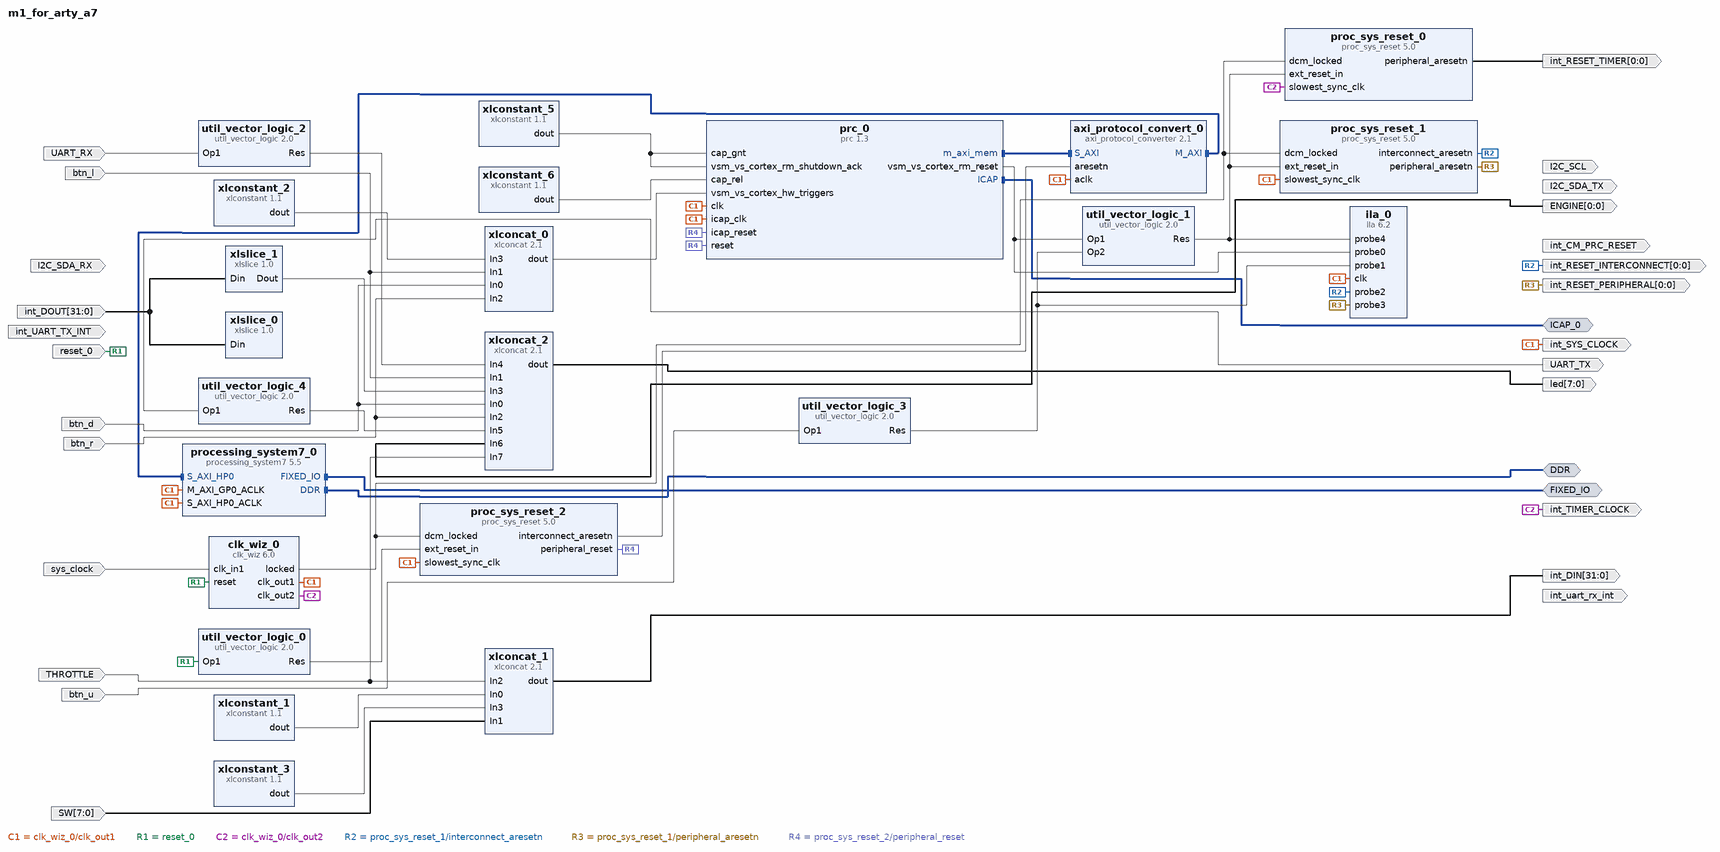
[diagram p0: block diagram of the top level]
# Vivado block design m1_for_arty_a7, xc7z020clg484-1, Vivado 2018.3
create_bd_design m1_for_arty_a7

create_bd_intf_port -mode Master -vlnv xilinx.com:interface:ddrx_rtl:1.0 DDR
create_bd_intf_port -mode Master -vlnv xilinx.com:display_processing_system7:fixedio_rtl:1.0 FIXED_IO
create_bd_intf_port -mode Master -vlnv xilinx.com:interface:icap_rtl:1.0 ICAP_0
create_bd_port -dir I -type rst reset_0
set_property -dict {CONFIG.POLARITY ACTIVE_HIGH} [get_bd_ports reset_0]
create_bd_port -dir I UART_RX
create_bd_port -dir I -type clk sys_clock
set_property -dict {CONFIG.FREQ_HZ 100000000 CONFIG.PHASE 0.000} [get_bd_ports sys_clock]
create_bd_port -dir O UART_TX
create_bd_port -dir I I2C_SDA_RX
create_bd_port -dir I THROTTLE
create_bd_port -dir O -from 7 -to 0 led
create_bd_port -dir O I2C_SDA_TX
create_bd_port -dir O I2C_SCL
create_bd_port -dir O -from 0 -to 0 ENGINE
create_bd_port -dir I -from 7 -to 0 SW
create_bd_port -dir O -from 0 -to 0 -type rst int_RESET_INTERCONNECT
create_bd_port -dir O -from 0 -to 0 -type rst int_RESET_PERIPHERAL
create_bd_port -dir O -from 0 -to 0 -type rst int_RESET_TIMER
create_bd_port -dir O -type clk int_SYS_CLOCK
create_bd_port -dir O -type clk int_TIMER_CLOCK
create_bd_port -dir I -from 31 -to 0 int_DOUT
create_bd_port -dir O int_uart_rx_int
create_bd_port -dir O -from 31 -to 0 int_DIN
create_bd_port -dir I btn_u
create_bd_port -dir I btn_d
create_bd_port -dir O int_CM_PRC_RESET
create_bd_port -dir I btn_r
create_bd_port -dir I btn_l
create_bd_port -dir I int_UART_TX_INT

create_bd_cell -type ip -vlnv xilinx.com:ip:processing_system7:5.5 processing_system7_0
set_property -dict [list \
  CONFIG.PCW_APU_PERIPHERAL_FREQMHZ 666.666667 \
  CONFIG.PCW_ENET0_PERIPHERAL_ENABLE 0 \
  CONFIG.PCW_FPGA0_PERIPHERAL_FREQMHZ 100.000000 \
  CONFIG.PCW_FPGA1_PERIPHERAL_FREQMHZ 150.000000 \
  CONFIG.PCW_GPIO_MIO_GPIO_ENABLE 1 \
  CONFIG.PCW_GPIO_MIO_GPIO_IO MIO \
  CONFIG.PCW_I2C_RESET_ENABLE 1 \
  CONFIG.PCW_PRESET_BANK1_VOLTAGE {LVCMOS 1.8V} \
  CONFIG.PCW_QSPI_PERIPHERAL_ENABLE 0 \
  CONFIG.PCW_SD0_GRP_CD_ENABLE 1 \
  CONFIG.PCW_SD0_GRP_CD_IO {MIO 47} \
  CONFIG.PCW_SD0_GRP_WP_ENABLE 1 \
  CONFIG.PCW_SD0_GRP_WP_IO {MIO 46} \
  CONFIG.PCW_SD0_PERIPHERAL_ENABLE 1 \
  CONFIG.PCW_SD0_SD0_IO {MIO 40 .. 45} \
  CONFIG.PCW_SDIO_PERIPHERAL_FREQMHZ 50 \
  CONFIG.PCW_S_AXI_HP0_DATA_WIDTH 32 \
  CONFIG.PCW_UART1_PERIPHERAL_ENABLE 1 \
  CONFIG.PCW_UART1_UART1_IO {MIO 48 .. 49} \
  CONFIG.PCW_UART_PERIPHERAL_FREQMHZ 50 \
  CONFIG.PCW_UIPARAM_DDR_FREQ_MHZ 533.333313 \
  CONFIG.PCW_UIPARAM_DDR_PARTNO {MT41J128M16 HA-15E} \
  CONFIG.PCW_USB0_PERIPHERAL_ENABLE 1 \
  CONFIG.PCW_USB0_RESET_ENABLE 0 \
  CONFIG.PCW_USB0_USB0_IO {MIO 28 .. 39} \
  CONFIG.PCW_USB_RESET_ENABLE 1 \
  CONFIG.PCW_USB_RESET_SELECT {Share reset pin} \
  CONFIG.PCW_USE_S_AXI_HP0 1 \
  CONFIG.preset ZedBoard \
] [get_bd_cells processing_system7_0]
# 220 more settings of processing_system7_0 are not shown: defaults, MIO pin electricals, DDR timing, and values the tool derives
create_bd_cell -type ip -vlnv xilinx.com:ip:clk_wiz:6.0 clk_wiz_0
set_property -dict [list \
  CONFIG.CLKOUT1_JITTER 130.958 \
  CONFIG.CLKOUT1_REQUESTED_OUT_FREQ 100 \
  CONFIG.CLKOUT2_JITTER 218.754 \
  CONFIG.CLKOUT2_PHASE_ERROR 98.575 \
  CONFIG.CLKOUT2_REQUESTED_OUT_FREQ 8.000 \
  CONFIG.CLKOUT2_USED true \
  CONFIG.CLK_IN1_BOARD_INTERFACE sys_clock \
  CONFIG.MMCM_CLKOUT0_DIVIDE_F 10.000 \
  CONFIG.MMCM_CLKOUT1_DIVIDE 125 \
  CONFIG.MMCM_DIVCLK_DIVIDE 1 \
  CONFIG.NUM_OUT_CLKS 2 \
  CONFIG.USE_RESET true \
] [get_bd_cells clk_wiz_0]
create_bd_cell -type ip -vlnv xilinx.com:ip:proc_sys_reset:5.0 proc_sys_reset_0
set_property -dict {CONFIG.C_EXT_RST_WIDTH 16} [get_bd_cells proc_sys_reset_0]
create_bd_cell -type ip -vlnv xilinx.com:ip:proc_sys_reset:5.0 proc_sys_reset_1
set_property -dict {CONFIG.C_EXT_RST_WIDTH 16 CONFIG.C_NUM_INTERCONNECT_ARESETN 1} [get_bd_cells proc_sys_reset_1]
create_bd_cell -type ip -vlnv xilinx.com:ip:xlconstant:1.1 xlconstant_2
set_property -dict {CONFIG.CONST_VAL 0 CONFIG.CONST_WIDTH 1} [get_bd_cells xlconstant_2]
create_bd_cell -type ip -vlnv xilinx.com:ip:xlconcat:2.1 xlconcat_1
set_property -dict [list \
  CONFIG.IN0_WIDTH 8 \
  CONFIG.IN1_WIDTH 8 \
  CONFIG.IN2_WIDTH 1 \
  CONFIG.IN3_WIDTH 15 \
  CONFIG.NUM_PORTS 4 \
] [get_bd_cells xlconcat_1]
create_bd_cell -type ip -vlnv xilinx.com:ip:xlconstant:1.1 xlconstant_1
set_property -dict {CONFIG.CONST_WIDTH 8} [get_bd_cells xlconstant_1]
create_bd_cell -type ip -vlnv xilinx.com:ip:xlslice:1.0 xlslice_0
set_property -dict {CONFIG.DIN_FROM 1 CONFIG.DIN_TO 1 CONFIG.DOUT_WIDTH 1} [get_bd_cells xlslice_0]
create_bd_cell -type ip -vlnv xilinx.com:ip:xlslice:1.0 xlslice_1
set_property -dict {CONFIG.DIN_FROM 0 CONFIG.DOUT_WIDTH 1} [get_bd_cells xlslice_1]
create_bd_cell -type ip -vlnv xilinx.com:ip:xlconstant:1.1 xlconstant_3
set_property -dict {CONFIG.CONST_WIDTH 15} [get_bd_cells xlconstant_3]
create_bd_cell -type ip -vlnv xilinx.com:ip:xlconcat:2.1 xlconcat_2
set_property -dict [list \
  CONFIG.IN0_WIDTH 1 \
  CONFIG.IN1_WIDTH 1 \
  CONFIG.IN2_WIDTH 1 \
  CONFIG.IN3_WIDTH 1 \
  CONFIG.IN4_WIDTH 1 \
  CONFIG.IN5_WIDTH 1 \
  CONFIG.IN6_WIDTH 1 \
  CONFIG.IN7_WIDTH 1 \
  CONFIG.NUM_PORTS 8 \
] [get_bd_cells xlconcat_2]
create_bd_cell -type ip -vlnv xilinx.com:ip:util_vector_logic:2.0 util_vector_logic_0
set_property -dict {CONFIG.C_OPERATION not CONFIG.C_SIZE 1} [get_bd_cells util_vector_logic_0]
create_bd_cell -type ip -vlnv xilinx.com:ip:prc:1.3 prc_0
set_property -dict [list \
  CONFIG.ALL_PARAMS {HAS_AXI_LITE_IF 0 RESET_ACTIVE_LEVEL 1 CP_FIFO_DEPTH 32 CP_FIFO_TYPE lutram CDC_STAGES 2 VS {vs_cortex {ID 0 NAME vs_cortex RM {cortex_ecu {ID 0 NAME cortex_ecu BS {0 {ID 0 ADDR 4194304 SIZE 1473436 CLEAR 0}} RESET_REQUIRED low RESET_DURATION 32} cortex_throttle {ID 1 NAME cortex_throttle BS {0 {ID 0 ADDR 8388608 SIZE 1473436 CLEAR 0}} RESET_REQUIRED low RESET_DURATION 32} cortex_engine {ID 2 NAME cortex_engine BS {0 {ID 0 ADDR 12582912 SIZE 1473436 CLEAR 0}} RESET_REQUIRED low RESET_DURATION 32} cortex_blank {ID 3 NAME cortex_blank BS {0 {ID 0 ADDR 16777216 SIZE 1473436 CLEAR 0}}}} POR_RM cortex_ecu HAS_AXIS_STATUS 1 HAS_POR_RM 1 RMS_ALLOCATED 4 NUM_HW_TRIGGERS 4 NUM_TRIGGERS_ALLOCATED 4 TRIGGER_TO_RM {}}} CP_FAMILY 7series DIRTY 3 CP_ARBITRATION_PROTOCOL 1} \
  CONFIG.GUI_BS_ADDRESS_0 0x00C00000 \
  CONFIG.GUI_BS_SIZE_0 1473436 \
  CONFIG.GUI_CDC_STAGES 2 \
  CONFIG.GUI_CP_ARBITRATION_PROTOCOL 1 \
  CONFIG.GUI_HAS_AXI_LITE false \
  CONFIG.GUI_LOCK_TRIGGER_1 false \
  CONFIG.GUI_LOCK_TRIGGER_2 false \
  CONFIG.GUI_RESET_ACTIVE_LEVEL 1 \
  CONFIG.GUI_RM_NEW_NAME cortex_engine \
  CONFIG.GUI_RM_RESET_DURATION 32 \
  CONFIG.GUI_RM_RESET_REQUIRED low \
  CONFIG.GUI_SELECT_RM 2 \
  CONFIG.GUI_SELECT_TRIGGER_1 1 \
  CONFIG.GUI_SELECT_TRIGGER_2 2 \
  CONFIG.GUI_SELECT_TRIGGER_3 3 \
  CONFIG.GUI_VS_HAS_AXIS_STATUS true \
  CONFIG.GUI_VS_HAS_POR_RM true \
  CONFIG.GUI_VS_NEW_NAME vs_cortex \
  CONFIG.GUI_VS_NUM_HW_TRIGGERS 4 \
  CONFIG.GUI_VS_NUM_RMS_ALLOCATED 4 \
  CONFIG.GUI_VS_NUM_TRIGGERS_ALLOCATED 4 \
] [get_bd_cells prc_0]
create_bd_cell -type ip -vlnv xilinx.com:ip:axi_protocol_converter:2.1 axi_protocol_convert_0
set_property -dict [list \
  CONFIG.MI_PROTOCOL AXI3 \
  CONFIG.READ_WRITE_MODE READ_ONLY \
  CONFIG.SI_PROTOCOL AXI4 \
  CONFIG.TRANSLATION_MODE 2 \
] [get_bd_cells axi_protocol_convert_0]
create_bd_cell -type ip -vlnv xilinx.com:ip:xlconstant:1.1 xlconstant_5
create_bd_cell -type ip -vlnv xilinx.com:ip:xlconstant:1.1 xlconstant_6
set_property -dict {CONFIG.CONST_VAL 0} [get_bd_cells xlconstant_6]
create_bd_cell -type ip -vlnv xilinx.com:ip:xlconcat:2.1 xlconcat_0
set_property -dict {CONFIG.NUM_PORTS 4} [get_bd_cells xlconcat_0]
create_bd_cell -type ip -vlnv xilinx.com:ip:util_vector_logic:2.0 util_vector_logic_3
set_property -dict {CONFIG.C_OPERATION not CONFIG.C_SIZE 1} [get_bd_cells util_vector_logic_3]
create_bd_cell -type ip -vlnv xilinx.com:ip:proc_sys_reset:5.0 proc_sys_reset_2
create_bd_cell -type ip -vlnv xilinx.com:ip:util_vector_logic:2.0 util_vector_logic_1
set_property -dict {CONFIG.C_OPERATION and CONFIG.C_SIZE 1} [get_bd_cells util_vector_logic_1]
create_bd_cell -type ip -vlnv xilinx.com:ip:util_vector_logic:2.0 util_vector_logic_2
set_property -dict {CONFIG.C_OPERATION not CONFIG.C_SIZE 1} [get_bd_cells util_vector_logic_2]
create_bd_cell -type ip -vlnv xilinx.com:ip:util_vector_logic:2.0 util_vector_logic_4
set_property -dict {CONFIG.C_OPERATION not CONFIG.C_SIZE 1} [get_bd_cells util_vector_logic_4]
create_bd_cell -type ip -vlnv xilinx.com:ip:ila:6.2 ila_0
set_property -dict {CONFIG.C_ENABLE_ILA_AXI_MON false CONFIG.C_MONITOR_TYPE Native CONFIG.C_NUM_OF_PROBES 5} [get_bd_cells ila_0]

# ---- connections ----

connect_bd_intf_net [get_bd_intf_pins prc_0/m_axi_mem] [get_bd_intf_pins axi_protocol_convert_0/S_AXI]
connect_bd_intf_net [get_bd_intf_pins axi_protocol_convert_0/M_AXI] [get_bd_intf_pins processing_system7_0/S_AXI_HP0]
connect_bd_intf_net [get_bd_intf_ports FIXED_IO] [get_bd_intf_pins processing_system7_0/FIXED_IO]
connect_bd_intf_net [get_bd_intf_ports ICAP_0] [get_bd_intf_pins prc_0/ICAP]
connect_bd_intf_net [get_bd_intf_ports DDR] [get_bd_intf_pins processing_system7_0/DDR]
connect_bd_net [get_bd_pins clk_wiz_0/clk_out1] \
  [get_bd_pins processing_system7_0/M_AXI_GP0_ACLK] [get_bd_pins proc_sys_reset_1/slowest_sync_clk] \
  [get_bd_ports int_SYS_CLOCK] [get_bd_pins processing_system7_0/S_AXI_HP0_ACLK] [get_bd_pins axi_protocol_convert_0/aclk] \
  [get_bd_pins prc_0/clk] [get_bd_pins prc_0/icap_clk] [get_bd_pins proc_sys_reset_2/slowest_sync_clk] \
  [get_bd_pins ila_0/clk]
connect_bd_net -net reset_0_2 [get_bd_ports reset_0] [get_bd_pins clk_wiz_0/reset] [get_bd_pins util_vector_logic_0/Op1]
connect_bd_net [get_bd_ports UART_RX] [get_bd_pins util_vector_logic_2/Op1]
connect_bd_net -net M04_ACLK_1 [get_bd_pins clk_wiz_0/clk_out2] [get_bd_pins proc_sys_reset_0/slowest_sync_clk] [get_bd_ports int_TIMER_CLOCK]
connect_bd_net [get_bd_ports sys_clock] [get_bd_pins clk_wiz_0/clk_in1]
connect_bd_net [get_bd_pins clk_wiz_0/locked] \
  [get_bd_pins proc_sys_reset_0/dcm_locked] [get_bd_pins proc_sys_reset_1/dcm_locked] \
  [get_bd_pins proc_sys_reset_2/dcm_locked]
connect_bd_net -net top_0_UART_TX_EXT [get_bd_ports UART_TX] [get_bd_pins util_vector_logic_4/Op1]
connect_bd_net -net cm1_ecu_wrapper_0_DOUT [get_bd_ports int_DOUT] [get_bd_pins xlslice_0/Din] [get_bd_pins xlslice_1/Din]
connect_bd_net [get_bd_pins xlconstant_1/dout] [get_bd_pins xlconcat_1/In0]
connect_bd_net [get_bd_ports THROTTLE] [get_bd_pins xlconcat_1/In2] [get_bd_pins xlconcat_2/In7]
connect_bd_net [get_bd_ports SW] [get_bd_pins xlconcat_1/In1]
connect_bd_net [get_bd_pins xlconstant_3/dout] [get_bd_pins xlconcat_1/In3]
connect_bd_net [get_bd_pins xlconcat_1/dout] [get_bd_ports int_DIN]
connect_bd_net [get_bd_pins xlconcat_2/dout] [get_bd_ports led]
connect_bd_net [get_bd_pins util_vector_logic_0/Res] [get_bd_pins proc_sys_reset_2/ext_reset_in]
connect_bd_net [get_bd_pins xlconstant_5/dout] [get_bd_pins prc_0/vsm_vs_cortex_rm_shutdown_ack] [get_bd_pins prc_0/cap_gnt]
connect_bd_net [get_bd_pins xlconstant_6/dout] [get_bd_pins prc_0/cap_rel]
connect_bd_net -net top_0_REC_THS [get_bd_ports btn_l] [get_bd_pins xlconcat_2/In1] [get_bd_pins xlconcat_0/In1]
connect_bd_net [get_bd_pins proc_sys_reset_1/interconnect_aresetn] [get_bd_ports int_RESET_INTERCONNECT] [get_bd_pins ila_0/probe2]
connect_bd_net [get_bd_pins proc_sys_reset_1/peripheral_aresetn] [get_bd_ports int_RESET_PERIPHERAL] [get_bd_pins ila_0/probe3]
connect_bd_net [get_bd_pins util_vector_logic_1/Res] \
  [get_bd_pins proc_sys_reset_1/ext_reset_in] [get_bd_pins proc_sys_reset_0/ext_reset_in] [get_bd_pins ila_0/probe4]
connect_bd_net [get_bd_pins proc_sys_reset_0/peripheral_aresetn] [get_bd_ports int_RESET_TIMER]
connect_bd_net [get_bd_pins xlconcat_0/dout] [get_bd_pins prc_0/vsm_vs_cortex_hw_triggers]
connect_bd_net [get_bd_ports btn_u] [get_bd_pins util_vector_logic_3/Op1]
connect_bd_net [get_bd_pins proc_sys_reset_2/peripheral_reset] [get_bd_pins prc_0/reset] [get_bd_pins prc_0/icap_reset]
connect_bd_net [get_bd_pins proc_sys_reset_2/interconnect_aresetn] [get_bd_pins axi_protocol_convert_0/aresetn]
connect_bd_net -net top_0_REC_ECU1 [get_bd_ports btn_d] [get_bd_pins xlconcat_0/In0] [get_bd_pins xlconcat_2/In0]
connect_bd_net -net top_0_REC_MCU [get_bd_ports btn_r] [get_bd_pins xlconcat_2/In2] [get_bd_pins xlconcat_0/In2]
connect_bd_net [get_bd_pins prc_0/vsm_vs_cortex_rm_reset] [get_bd_pins util_vector_logic_1/Op1] [get_bd_pins ila_0/probe0]
connect_bd_net [get_bd_pins util_vector_logic_3/Res] [get_bd_pins util_vector_logic_1/Op2] [get_bd_pins ila_0/probe1]
connect_bd_net -net top_0_MCU_GPIO_EXT [get_bd_ports ENGINE] [get_bd_pins xlconcat_2/In6]
connect_bd_net [get_bd_pins xlslice_1/Dout] [get_bd_pins xlconcat_2/In3]
connect_bd_net [get_bd_pins util_vector_logic_2/Res] [get_bd_pins xlconcat_2/In4]
connect_bd_net [get_bd_pins util_vector_logic_4/Res] [get_bd_pins xlconcat_2/In5]
connect_bd_net [get_bd_pins xlconstant_2/dout] [get_bd_pins xlconcat_0/In3]

validate_bd_design
save_bd_design
